# EAGLE design Sonar-Amplifier-Prototype (EAGLE 8.6.0)
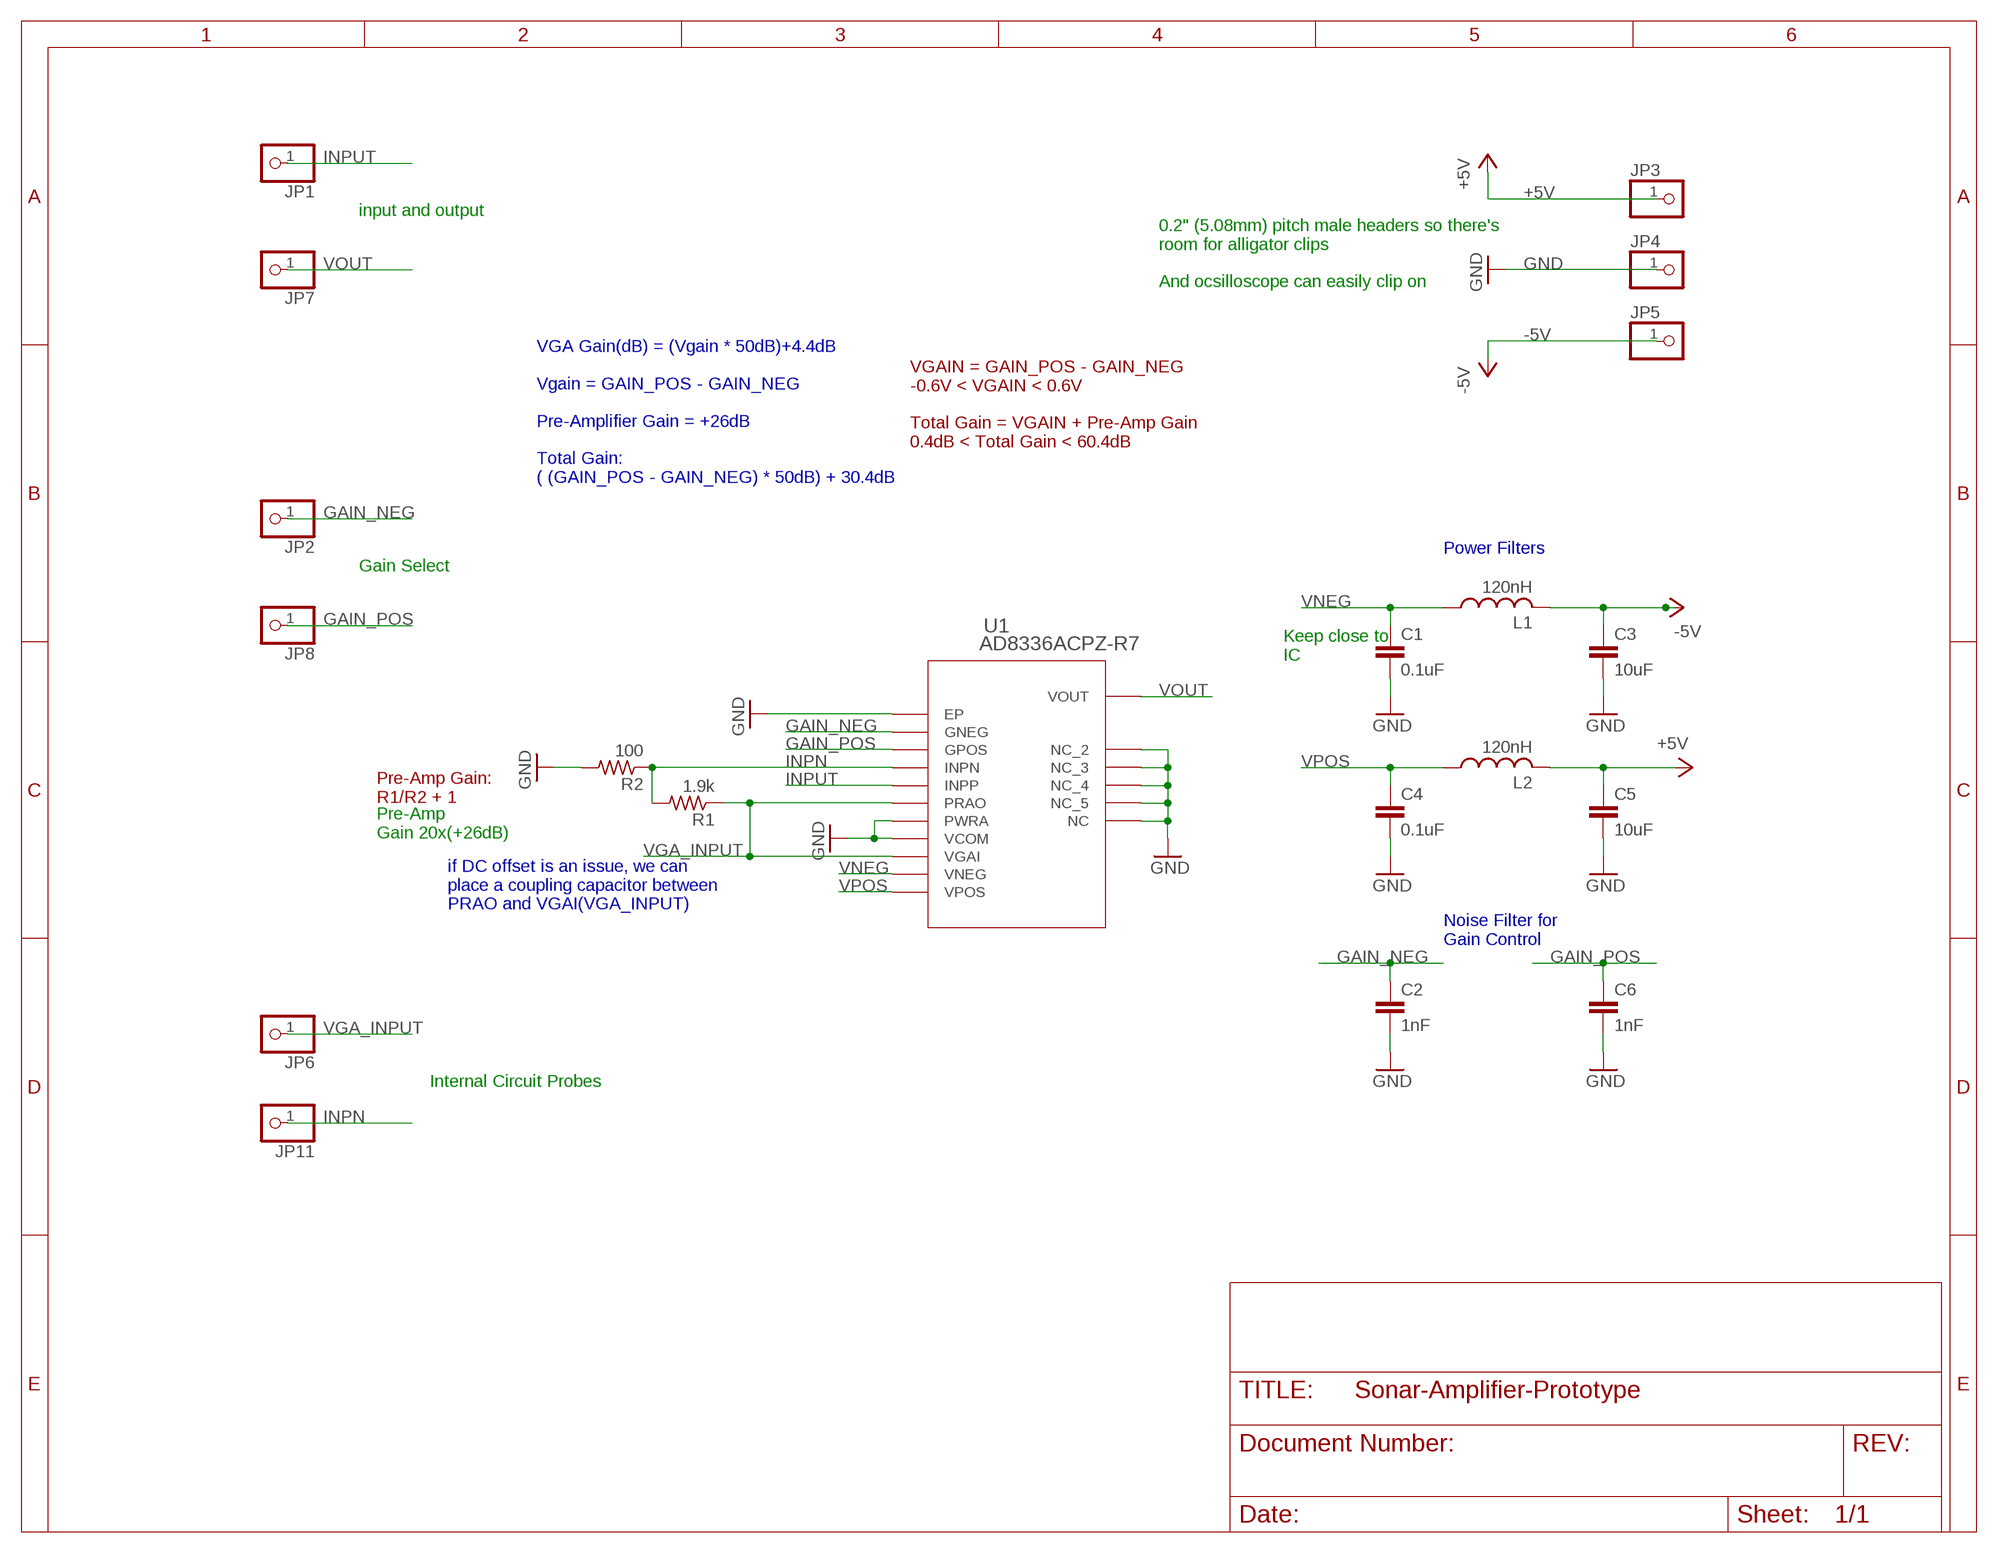
[diagram p0: schematic, sheet 1]

## Parts
C1  0.1uF  C-EUC0603  [C0603]
C2  1nF  C-EUC0603  [C0603]
C3  10uF  C-EUC1206  [C1206]
C4  0.1uF  C-EUC0603  [C0603]
C5  10uF  C-EUC1206  [C1206]
C6  1nF  C-EUC0603  [C0603]
JP1  PINHD-1X1  [1X01]
JP2  PINHD-1X1  [1X01]
JP3  PINHD-1X1  [1X01]
JP4  PINHD-1X1  [1X01]
JP5  PINHD-1X1  [1X01]
JP6  PINHD-1X1  [1X01]
JP7  PINHD-1X1  [1X01]
JP8  PINHD-1X1  [1X01]
JP11  PINHD-1X1  [1X01]
L1  120nH  L-USL3225P  [L3225P]
L2  120nH  L-USL3225P  [L3225P]
R1  1.9k  R-US_R0603  [R0603]
R2  100  R-US_R0603  [R0603]
U1  AD8336ACPZ-R7  [CP_16_4]

## Nets
+5V: C5.1 JP3.1 L2.2
-5V: C3.1 JP5.1 L1.2
GAIN_NEG: C2.1 JP2.1 U1.GNEG
GAIN_POS: C6.1 JP8.1 U1.GPOS
GND: C1.2 C2.2 C3.2 C4.2 C5.2 C6.2 JP4.1 R2.2 U1.GND1(EP) U1.NC U1.NC1(NC_2) U1.NC2(NC_3) U1.NC3(NC_4) U1.NC4(NC_5) U1.PWRA U1.VCOM
INPN: JP11.1 R1.2 R2.1 U1.INPN
INPUT: JP1.1 U1.INPP
VGA_INPUT: JP6.1 R1.1 U1.PRAO U1.VGAI
VNEG: C1.1 L1.1 U1.VNEG
VOUT: JP7.1 U1.VOUT
VPOS: C4.1 L2.1 U1.VPOS

## Notes on the sheet
- input and output
- 0.2" (5.08mm) pitch male headers so there's
  room for alligator clips
  
  And ocsilloscope can easily clip on
- VGAIN = GAIN_POS - GAIN_NEG
  -0.6V < VGAIN < 0.6V
  
  Total Gain = VGAIN + Pre-Amp Gain
  0.4dB < Total Gain < 60.4dB
- VGA Gain(dB) = (Vgain * 50dB)+4.4dB
  
  Vgain = GAIN_POS - GAIN_NEG
  
  Pre-Amplifier Gain = +26dB
  
  Total Gain:
  ( (GAIN_POS - GAIN_NEG) * 50dB) + 30.4dB
- Power Filters
- Gain Select
- Keep close to 
  IC
- Pre-Amp Gain:
  R1/R2 + 1
- Pre-Amp 
  Gain 20x(+26dB)
- if DC offset is an issue, we can
  place a coupling capacitor between
  PRAO and VGAI(VGA_INPUT)
- Noise Filter for
  Gain Control
- Internal Circuit Probes

## Library data of the parts
C1 C2 C4 C6 = rcl:C-EU: CAPACITOR, European symbol; SPICEPREFIX: C
C3 C5 = resistor:C-EU: CAPACITOR, European symbol
JP1-JP8 JP11 = pinhead:PINHD-1X1: PIN HEADER
L1 L2 = resistor:L-US: INDUCTOR, American symbol
R1 R2 = rcl:R-US_: RESISTOR, American symbol; SPICEPREFIX: R
U1 = Amplifier-Sonar-LBR:AD8336ACPZ-R7; MANUFACTURER_PART_NUMBER: AD8336ACPZR7; VENDOR: Analog Devices Inc

## Board
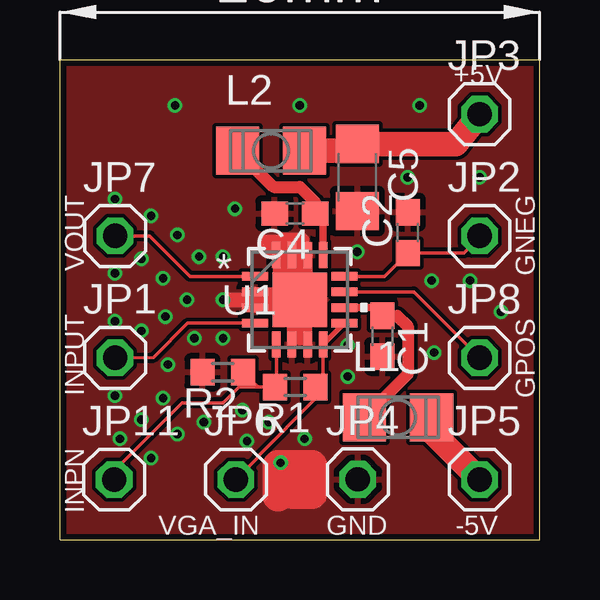
[diagram p1: board, top side]
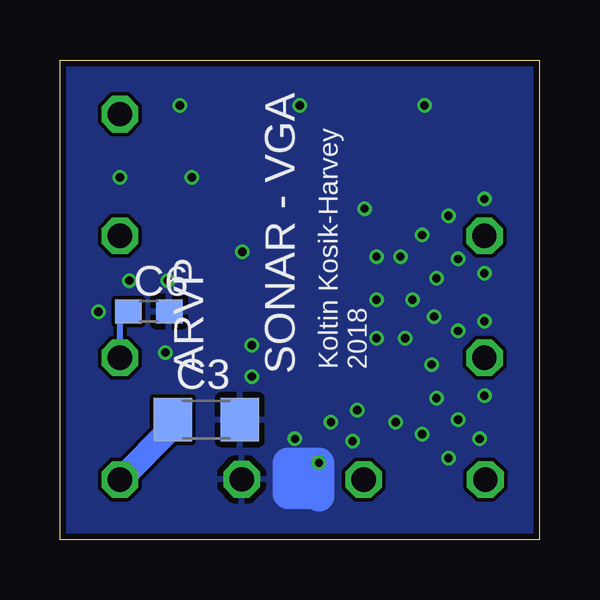
[diagram p2: board, bottom side, seen from below]

Size 20 x 20 mm. Coordinates in mm from the lower left corner, seen from the top.
Outline: 0,0 20,0 20,20 0,20 0,0
Copper layers (1*16): Top 0.035mm / dielectric 1.5mm / Bottom 0.035mm
Design rules "OSHPark2Layer": minimum track width 6mil, minimum drill 10mil, track to track 6mil, track to pad 6mil, pad to pad 6mil, via to via 6mil, smd to smd 0mil, copper to edge 10mil, drill to drill 10mil, minimum pad ring 5mil, minimum via ring 5mil, stop-mask expansion 2mil, vias tented up to drill 100mil, thermal gap 10mil

### Footprints (pad centres in the part's own frame; a part is rotated, then mirrored left to right if it is on the bottom)
C0603 = smd 1.1 x 1: 1 -0.85,0; 2 0.85,0
C1206 = smd 1.6 x 1.8: 1 -1.4,0; 2 1.4,0
1X01 = drill 1.016 octagon: 1 0,0
L3225P = smd 1.8 x 2: 1 -1.4,0; 2 1.4,0
R0603 = smd 1 x 1.1: 1 -0.85,0; 2 0.85,0
CP_16_4 = smd 2.261 x 2.261: GND1 0,0 | smd 1.067 x 0.356: GNEG 1.865,0.975; GPOS 1.865,0.325; INPP -1.865,-0.975; PWRA -1.865,0.325; VCOM -1.865,-0.325; VGAI 1.865,-0.975; VNEG 1.865,-0.325; VOUT -1.865,0.975 | smd 0.356 x 1.067: INPN -0.975,-1.865; NC 0.325,-1.865; NC1 -0.325,-1.865; NC2 0.325,1.865; NC3 -0.325,1.865; NC4 -0.975,1.865; PRAO 0.975,-1.865; VPOS 0.975,1.865

### Placement (x,y rotation side)
C1  13.44,8.48 270 top
C2  14.5,12.8 90 top
C3  13.9,5 0 bottom
C4  9.8,13.6 180 top
C5  12.4,15.1 270 top
C6  16.29,9.52 0 bottom
JP1  2.3,7.58 0 top
JP2  17.5,12.66 0 top
JP3  17.5,17.74 0 top
JP4  12.42,2.51 0 top
JP5  17.5,2.5 0 top
JP6  7.34,2.5 0 top
JP7  2.3,12.66 0 top
JP8  17.5,7.58 0 top
JP11  2.26,2.5 0 top
L1  14.1,5.1 0 top
L2  8.8,16.21 0 top
R1  9.81,6.36 180 top
R2  6.79,6.98 180 top
U1  10,10 0 top

### Tracks (layer width: path | path; a pad name or v marks a point on that pad's centre or on a via)
+5V
  Top 1.016: JP3.1 16.5,16.5 C5.1 12.11,16.21 L2.2
-5V
  Top 1.016: JP5.1 15.5,4.5 L1.2
  Bottom 1.016: JP5.1 15.3,4.7 C3.1
GAIN_NEG
  Top 0.152: JP2.1 16.85,11.95 C2.1 13.53,10.97 U1.GNEG
GAIN_POS
  Top 0.152: U1.GPOS 14.76,10.32 JP8.1
  Bottom 0.254: JP8.1 17.5,9.56 C6.1
GND  (via drill 0.35)
  Top 0.127: 8.7,12.19 U1.NC4
  Top 0.152: 9.68,9.68 9.9,9.9 | 9.9,9.9 U1.GND1 | 10.32,9.68 10.05,9.95 | 10.05,9.95 U1.GND1 | 9.78,9.68 10.05,9.95 | 9.03,10.78 9.9,9.9 | 9.68,10.32 9.95,10.05 | 10.32,10.43 9.95,10.05 | 9.95,10.05 U1.GND1 | 10.28,9.66 10.28,8.12 10,8.4 | 8.46,10 U1.PWRA | 8.7,12.4 8.7,12.19 | U1.GND1 9.3,10.7 9.3,11
  Top 0.305: U1.NC4 9.03,10.78
  Top 0.406: U1.NC1 9.68,9.68 | U1.NC 10.32,9.68 | U1.VCOM 9.78,9.68 | U1.NC3 9.68,10.32 U1.PWRA | U1.NC2 10.32,10.43
  Top 0.61: 10,8.4 U1.GND1 8.46,10 v6.8,10 | 9.3,11 9.3,12.5 10.1,12.5 10.1,10.9 | 9.7,12.4 8.7,12.4 8.6,12.4 arc-90 8.7,12.3 8.7,12.1
  Top 1.27: 9.1,1.8 9.1,3.1 10.5,3.1 10.5,1.9 9.7,1.9
  Bottom 1.27: 9.2,1.8 v9.2,3.2 10.5,3.2 10.5,1.9 9.6,1.9
  other vias: 2.3,14.2 2.3,6 17.5,15.1 10,18.1 4.8,18.1 15,18.1 12.4,12 15.6,7.8 12,8.1 4.9,4.4 5.3,10 3.4,11.7 3.4,8.7 3.8,13.5 4.9,12.7 5.8,11.8 6.8,11.8 4.5,7.3 5.6,8.4 6.8,8.4 4.3,10.9 4.4,9.3 2.3,9.1 2.3,11.1 7.3,13.8 4.3,5.9 3.4,5 2.5,4.2 7.6,5.4 3.8,3.4 6,4.9 12,6.8 18.4,9.5 15.5,10.8 17.1,10.8 10.2,4.2 8.7,4.9 7.8,4.1 14.5,15.1
  pour Bottom: -3,23 23,23 23,-3 -3,-3
  pour Top: -2,22 -2,-2 22,-2 22,21 22,22
INPN
  Top 0.152: U1.INPN 9.03,6.42 R1.2 | R1.2 8.26,6.36 R2.1 | R2.1 7.64,6.54 7.46,6.36 | JP11.1 2.3,2.9 5.1,5.7 6.8,5.7 7.45,6.35 7.46,6.36 | R1.2 7.46,6.36 | 7.46,6.36 7.46,6.8 R2.1
INPUT
  Top 0.152: JP1.1 3.9,7.6 5.33,9.03 U1.INPP
VGA_INPUT
  Top 0.152: U1.PRAO 10.97,6.67 R1.1 10.66,5.88 8.24,3.46 8.24,3.4 JP6.1
  Top 0.2: U1.VGAI U1.PRAO
VNEG
  Top 0.305: U1.VNEG 13.2,9.68 C1.1
  Top 0.508: C1.1 14.07,9.33 14.5,8.9 14.5,6.9 L1.1
VOUT
  Top 0.152: U1.VOUT 5.42,10.97 3.74,12.66 JP7.1
VPOS
  Top 0.305: U1.VPOS 10.97,13.28 C4.1
  Top 0.508: L2.1 8.91,14.7 10,14.7 10.65,14.05 C4.1

### Text on the board
tPlace: +5V | VOUT | GNEG | INPUT | GPOS | INPN | VGA_IN | GND | -5V
bPlace: Koltin Kosik-Harvey / 2018 | ARVP / / SONAR - VGA